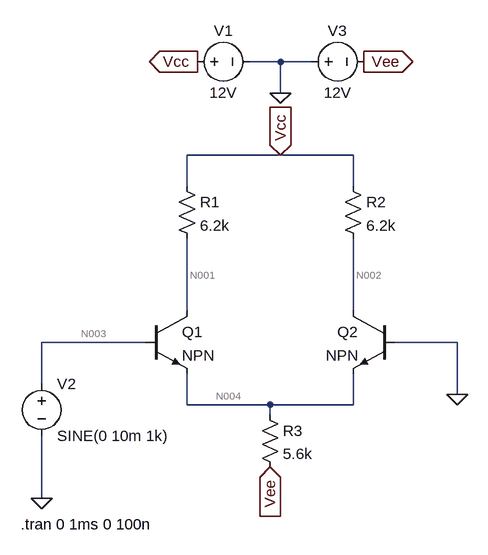
[diagram p0: schematic diff_amp.asc]
diff_amp.asc, the LTspice schematic file:
Version 4.1
SHEET 1 880 708
WIRE 16 -96 -32 -96
WIRE 64 -96 16 -96
WIRE 16 -48 16 -96
WIRE 16 48 -128 48
WIRE 128 48 16 48
WIRE -128 96 -128 48
WIRE 128 96 128 48
WIRE -128 288 -128 176
WIRE 128 288 128 176
WIRE -192 336 -352 336
WIRE 288 336 192 336
WIRE -352 400 -352 336
WIRE 288 416 288 336
WIRE -128 432 -128 384
WIRE 0 432 -128 432
WIRE 128 432 128 384
WIRE 128 432 0 432
WIRE 0 448 0 432
WIRE -352 576 -352 480
FLAG -352 576 0
FLAG 288 416 0
FLAG 16 -48 0
FLAG -112 -96 Vcc
IOPIN -112 -96 Out
FLAG 144 -96 Vee
IOPIN 144 -96 Out
FLAG 0 528 Vee
IOPIN 0 528 In
FLAG 16 48 Vcc
IOPIN 16 48 In
SYMBOL voltage -128 -96 R270
WINDOW 0 32 56 VTop 2
WINDOW 3 -32 56 VBottom 2
WINDOW 123 0 0 Left 0
WINDOW 39 0 0 Left 0
SYMATTR InstName V1
SYMATTR Value 12V
SYMBOL npn -192 288 R0
SYMATTR InstName Q1
SYMBOL npn 192 288 M0
SYMATTR InstName Q2
SYMBOL res -144 80 R0
SYMATTR InstName R1
SYMATTR Value 6.2k
SYMBOL res 112 80 R0
SYMATTR InstName R2
SYMATTR Value 6.2k
SYMBOL res -16 432 R0
SYMATTR InstName R3
SYMATTR Value 5.6k
SYMBOL voltage -352 384 R0
WINDOW 123 0 0 Left 0
WINDOW 39 0 0 Left 0
SYMATTR InstName V2
SYMATTR Value SINE(0 10m 1k)
SYMBOL voltage 48 -96 R270
WINDOW 0 32 56 VTop 2
WINDOW 3 -32 56 VBottom 2
WINDOW 123 0 0 Left 0
WINDOW 39 0 0 Left 0
SYMATTR InstName V3
SYMATTR Value 12V
TEXT -384 616 Left 2 !.tran 0 1ms 0 100n

The netlist it stands for:
* diff_amp.asc
V1 Vcc 0 12V
Q1 N001 N003 N004 0 NPN
Q2 N002 0 N004 0 NPN
R1 Vcc N001 6.2k
R2 Vcc N002 6.2k
R3 N004 Vee 5.6k
V2 N003 0 SINE(0 10m 1k)
V3 0 Vee 12V
.model NPN NPN
.model PNP PNP
.lib standard.bjt
.tran 0 1ms 0 100n
.backanno
.end

* Results of the author's LTspice run, read from the files saved beside the schematic
* Operating Point, zero values left out:
*   V(n001) = 5.847 V
*   V(n004) = -774 mV
*   V(n002) = 5.847 V
*   V(vcc) = 12 V
*   V(vee) = -12 V
*   I(V1) = -1.985 mA
*   Ic(Q2) = 992.4 µA
*   Ib(Q2) = 9.924 µA
*   Ie(Q2) = -1.002 mA
*   I(R2) = 992.4 µA
*   I(R3) = 2.005 mA
*   I(V3) = -2.005 mA
*   Ic(Q1) = 992.4 µA
*   Ib(Q1) = 9.924 µA
*   Ie(Q1) = -1.002 mA
*   I(R1) = 992.4 µA
*   I(V2) = -9.924 µA
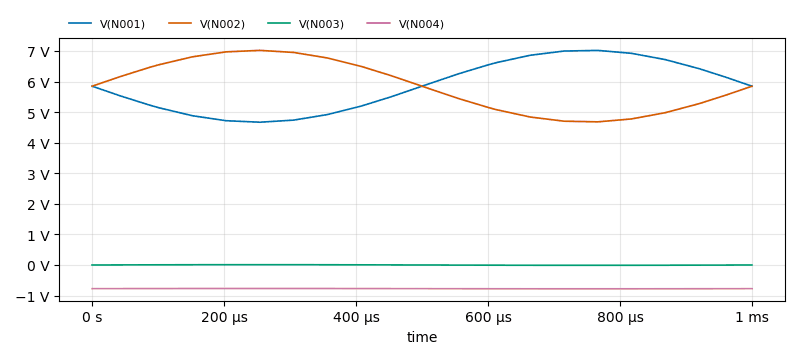
[diagram p1: Transient Analysis of diff_amp.asc, plotted from the saved traces]
* Transient Analysis, 1 run:
*   V(N001): min 4.669 V, max 7.018 V, average 5.847 V, rms 5.906 V, last 5.847 V
*   V(N002): min 4.681 V, max 7.019 V, average 5.847 V, rms 5.906 V, last 5.847 V
*   V(N003): min -9.947 mV, max 9.996 mV, average -51.96 nV, rms 7.059 mV, last 0 V
*   V(N004): min -778.5 mV, max -768.6 mV, average -773.8 mV, rms 773.8 mV, last -774 mV